# EasyEDA schematic RUN-Reset.json
TITLE: Sheet_1; REV: 1.0; Date: 2023-09-01; Sheet: 1/1; Drawn By: nicolasvig; Company: Your Company
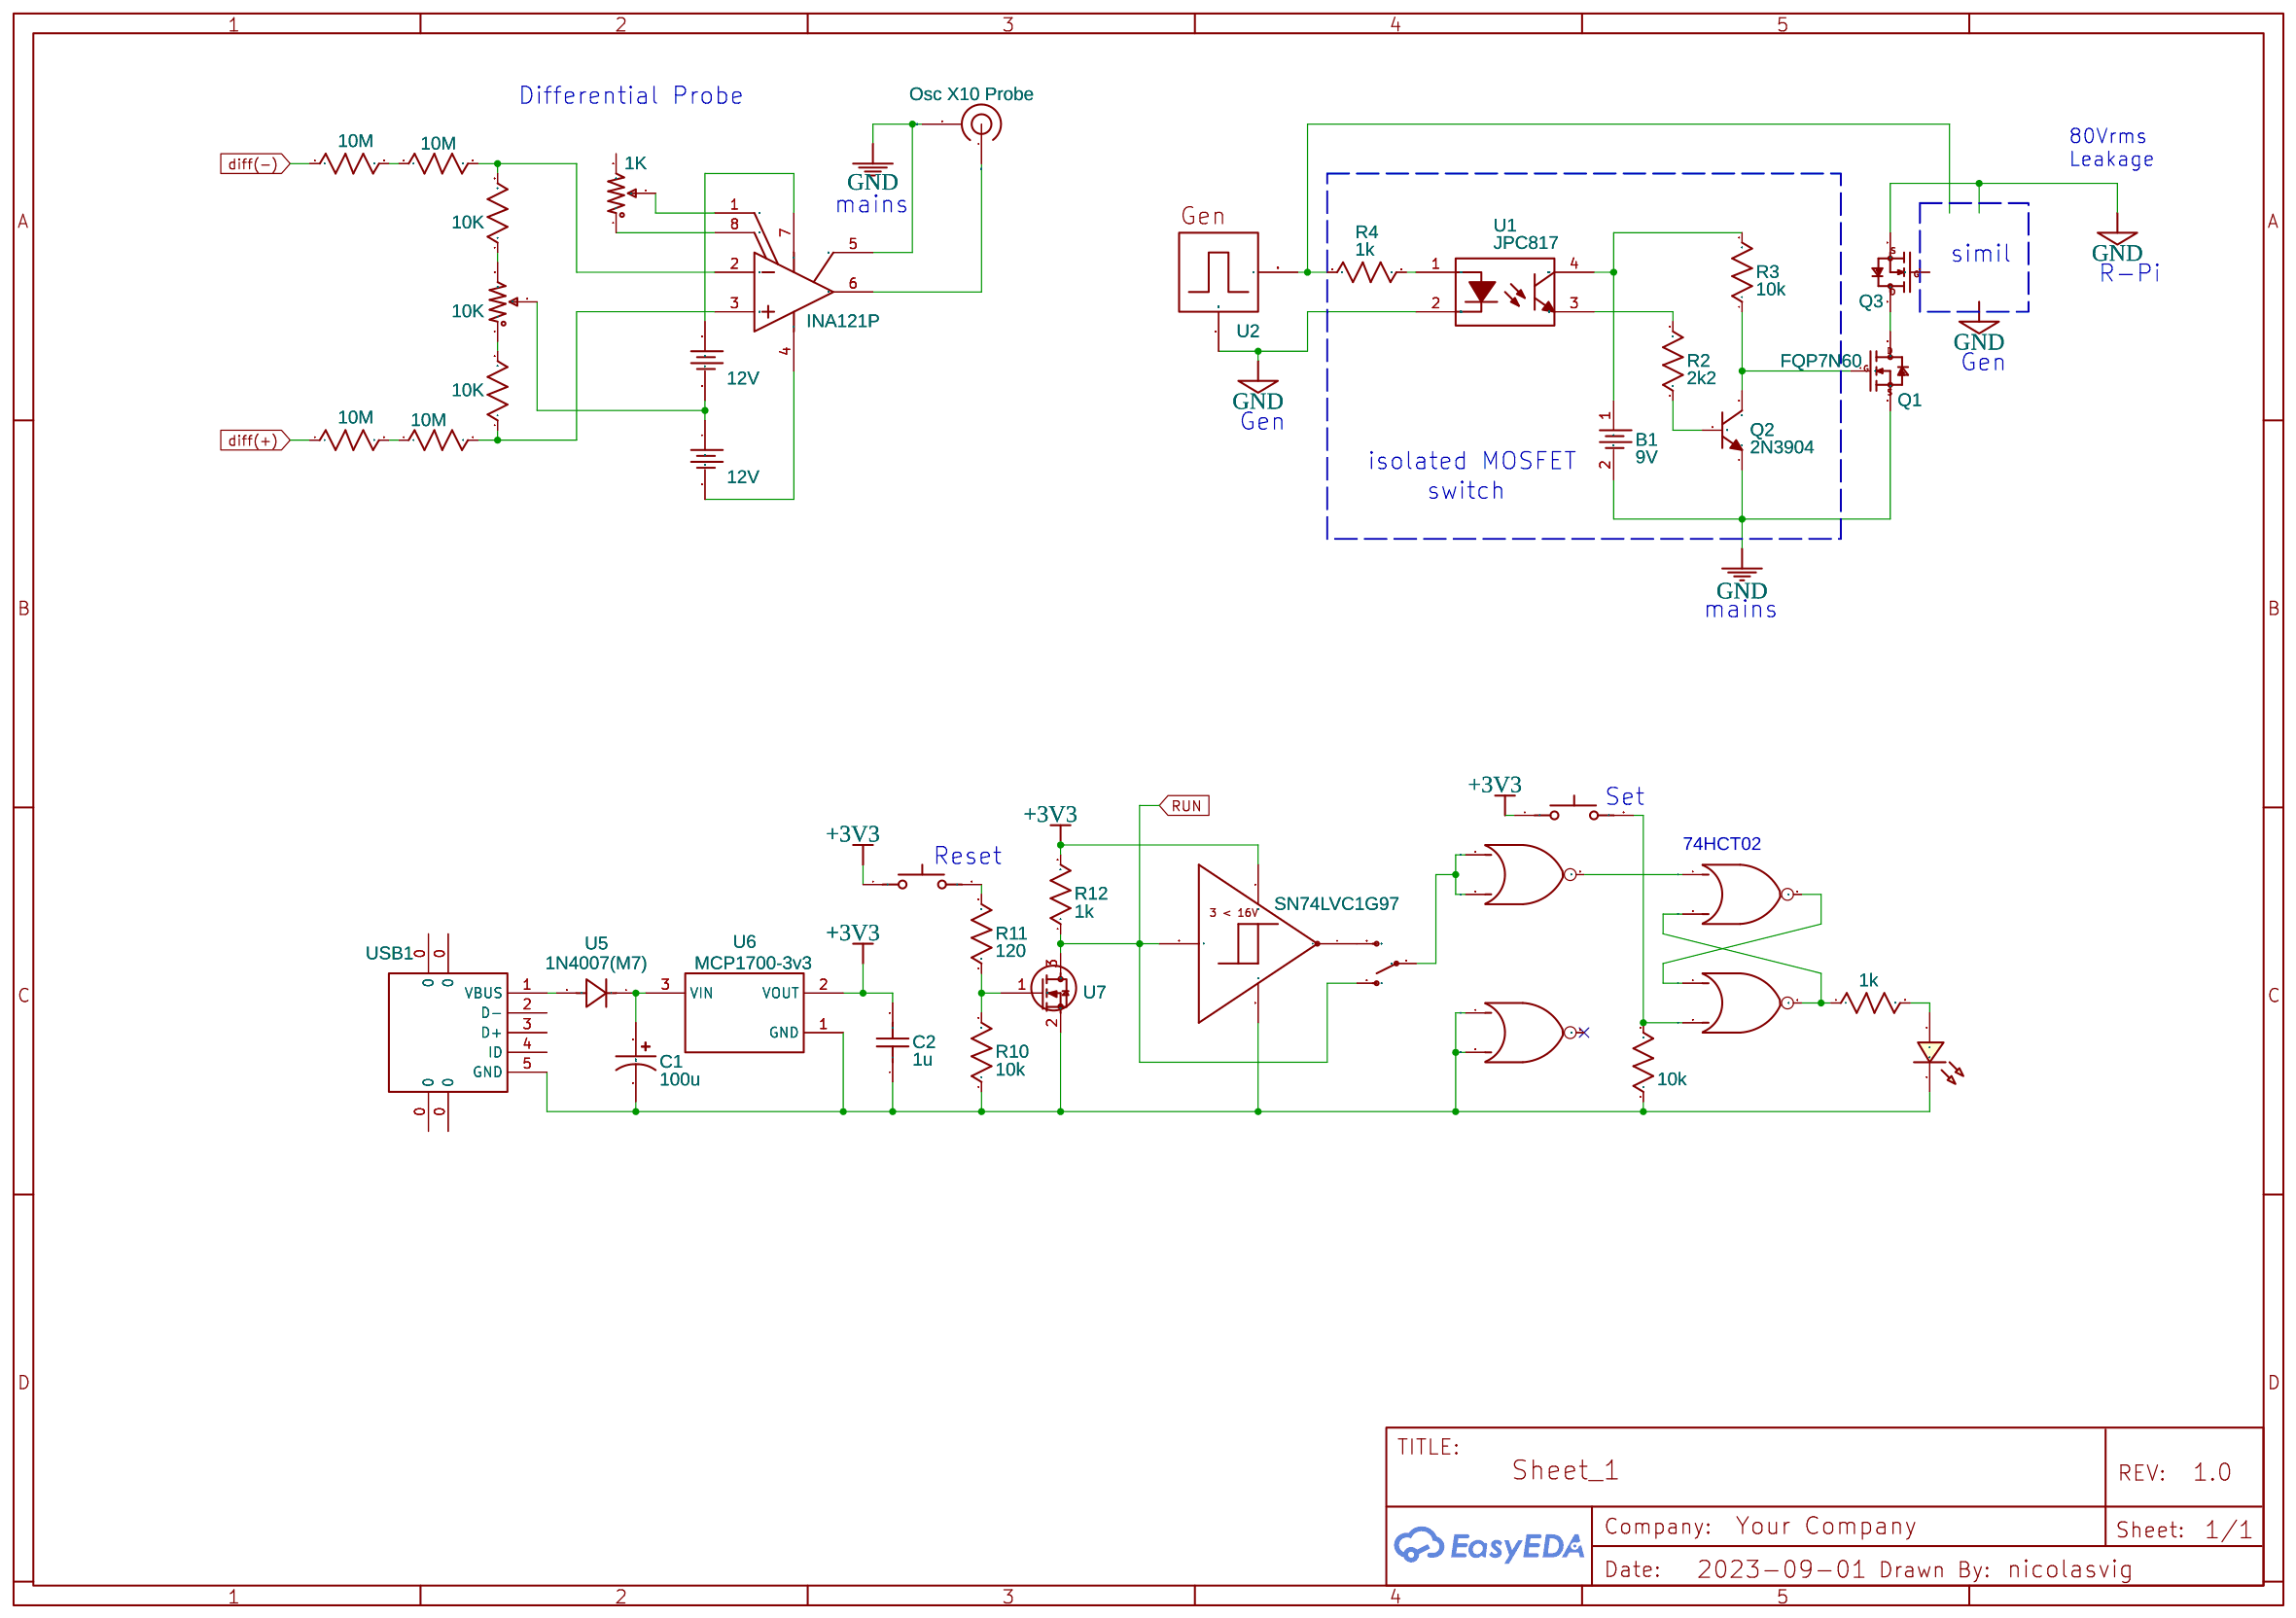
[diagram p0: schematic sheet]

## Parts
B1  9V  [BAT-SMD_CR1220-2]
B2  12V  [BAT-SMD_CR1220-2]
B3  12V  [BAT-SMD_CR1220-2]
C1  100u  [CASE-A_3216]
C2  1u  [C0603]
LED1  LED-0603_R  [LED0603_RED]
Q1  FQP7N60  [SEEED-SOT-23]
Q2  2N3904  [TO-92-3_L5.1-W4.1-P1.27-L]
Q3  NO  [SEEED-SOT-23]
R1  10M  [R0603]
R2  2k2  [R0603]
R3  10k  [R0603]
R4  1k  [R0603]
R5  10M  [R0603]
R6  10M  [R0603]
R7  10M  [R0603]
R8  10K  [R0603]
R9  10K  [R0603]
R10  10k  [R0603]
R11  120  [R0603]
R12  1k  [R0603]
R13  1k  [R0603]
R14  10k  [R0603]
RP1  1K  [RES-ADJ-TH_3386P]
RP2  10K  [RES-ADJ-TH_3386P]
S1  SWITCH-SPDT Panelmount  [STDP GABBAGABI]
SN74LVC1G97  -  [SCHMITT INVERTER]
U1  JPC817  [DIP-4_L6.5-W4.6-P2.54-LS7.6-BL]
U2  NO  [FUNCTION GENERATOR KK]
U3  Osc X10 Probe  [COAX PCB]
U4  INA121P  [PDIP-8_L9.5-W6.4-P2.54-LS7.6-BL]
U5  1N4007(M7)  [SMA_L4.3-W2.7-LS5.1-RD]
U6  MCP1700-3v3  [SOT-23-3_L2.9-W1.3-P1.90-LS2.4-BR]
U7  -  [2N7002]
U8  BUTTON2  [SW-SMD_L6.0-W3.5-LS8.0-1]
U9  -
U10  -
U11  -
U12  -
U13  BUTTON2  [SW-SMD_L6.0-W3.5-LS8.0-1]
USB1  micro 5P_C77238  [MICRO-USB_MICRO-USB-17]

## Library data of the parts
B1-B3 = CR1220-2: Supplier: LCSC; Manufacturer: Q&J; image: //image.lceda.cn/szlcsc/C70381.jpg; Supplier Part: C70381
C1 = C_Tan_SMD_A_US: Contributor: LCEDA_Lib
C2 = C_0603_US: Contributor: LCEDA_Lib
LED1 = LED-0603_R: Manufacturer: EVERLIGHT(台湾亿光); Manufacturer Part: 19-217/R6C-AL1M2VY/3T; Supplier Part: C72044; Supplier: LCSC; Contributor: LCEDA_01
Q1 Q3 = MOSFET-N: sourceId: lTtPN9uQc
Q2 = 2N3904: Supplier: LCSC; Manufacturer: ST(先科); Supplier Part: C118538; JLCPCB Part Class: Extended Part; link: https://lcsc.com/eda_search?q=C118538&%26type=1&ref=editor
R1-R14 = R_0603_US: Contributor: LCEDA_Lib
RP1 = R_3386P_US: Supplier: LCSC; Contributor: LCEDA_Lib; value(Ω): 10K
RP2 = R_3386P_US: Supplier: LCSC; Contributor: LCEDA_Lib
S1 = SWITCH-SPDT Panelmount: Contributor: gabbagabi
SN74LVC1G97 = Schmitt Inverter: Manufacturer: ROHM Semiconductor; Manufacturer Part: BU4S584G2-TR; Supplier: Mouser; link: https://www.mouser.tw/ProductDetail/ROHM-Semiconductor/BU4S584G2-TR?qs=%2Fha2pyFadujrli%252BPTslmoLvNkPYOHJBJfyhxRCxfzx0KWZPwSXGCuA%3D%3D; Contributor: hunglaa; Rated Power: 0.67; Rated Voltage: 16
U1 = JPC817: Contributor: lcsc; Supplier: LCSC; Supplier Part: C5365399; Manufacturer: JUXING(钜兴); link: https://lcsc.com/eda_search?q=C5365399&%26type=1&ref=editor
U2 = Function generator copy: Contributor: Schwamela
U3 = coax: Contributor: nomouelle
U4 = INA121P: Contributor: LCSC; Supplier: LCSC; Supplier Part: C1347772; Manufacturer: TI(德州仪器); JLCPCB Part Class: Extended Part; link: https://lcsc.com/eda_search?q=C1347772&%26type=1&ref=editor
U5 = 1N4007(M7): Contributor: lcsc; Supplier: LCSC; Supplier Part: C2988638; Manufacturer: UMW(广东友台半导体); JLCPCB Part Class: Extended Part; link: https://lcsc.com/eda_search?q=C2988638&%26type=1&ref=editor
U6 = MCP1700T-3002E/TT: Supplier: LCSC; Manufacturer: MICROCHIP(美国微芯); Supplier Part: C62244; JLCPCB Part Class: Extended Part; link: https://lcsc.com/eda_search?q=C62244&%26type=1&ref=editor
U7 = 2N7002-: Contributor: DrSavitaGaur; Supplier: SeeedStudio
U8 U13 = BUTTON2: Contributor: LCSC; Supplier: LCSC; Supplier Part: C9900005988; Manufacturer: null; JLCPCB Part Class: Extended Part; link: https://lcsc.com/eda_search?q=C9900005988&%26type=1&ref=editor
U9-U12 = NorGate
USB1 = micro 5P_C77238: Contributor: 立创EDA官方封装库; Supplier: LCSC; Supplier Part: C77238; Manufacturer: 精拓金; Manufacturer Part: 920-D62A2021S10107; JLCPCB Part Class: Extended Part; link: https://lcsc.com/eda_search?q=C77238&%26type=1&ref=editor

## Nets
+3V3: C2.2 R12.2 SN74LVC1G97.5 U6.2(VOUT) U8.1 U13.1
GND: B1.2 Q1.2(S) Q2.1(E) Q3.2(S) U1.2(Cathode) U2.1(Ground) U4.5(Ref)
diff(+): R7.1
diff(-): R6.1
RUN: R12.1 S1.2(O) SN74LVC1G97.2 U7.3(D)
Net-(B1-1): B1.1 R3.2 U1.4(Collector)
Net-(B2-1): B2.1 U4.7(V+)
Net-(B2-2): B2.2 B3.1 RP2.2
Net-(B3-2): B3.2 U4.4(V-)
Net-(C1-1): C1.1 U5.1(K) U6.3(VIN)
Net-(C1-2): C1.2 C2.1 LED1.2 R10.1 R14.1 SN74LVC1G97.3 U6.1(GND) U7.2(S) U10.1 U10.2 USB1.5(GND)
Net-(LED1-1): LED1.1 R13.2
Net-(Q1-1): Q1.1(G) Q2.3(C) R3.1
Net-(Q1-3): Q1.3(D) Q3.3(D)
Net-(Q2-2): Q2.2(B) R2.1
Net-(R1-1): R1.1 R6.2
Net-(R1-2): R1.2 R8.2 U4.2(V– IN)
Net-(R2-2): R2.2 U1.3(Emitter)
Net-(R4-1): R4.1 U2..(2)
Net-(R4-2): R4.2 U1.1(Anode)
Net-(R5-1): R5.1 R7.2
Net-(R5-2): R5.2 R9.1 U4.3(V+ IN)
Net-(R8-1): R8.1 RP2.3
Net-(R9-2): R9.2 RP2.1
Net-(R10-2): R10.2 R11.1 U7.1(G)
Net-(R11-2): R11.2 U8.2
Net-(R13-1): R13.1 U11.2 U12.3
Net-(R14-2): R14.2 U12.2 U13.2
Net-(RP1-1): RP1.1 U4.8(RG)
Net-(RP1-2): RP1.2 U4.1(RG)
Net-(S1-1): S1.1(P) U9.1 U9.2
Net-(S1-3): S1.3(S) SN74LVC1G97.4
Net-(U5-2): U5.2(A) USB1.1(VBUS)
Net-(U9-3): U9.3 U11.1
Net-(U11-3): U11.3 U12.1

Not connected (* = marked no-connect by the designer): Q3 1(G); RP1 3; U3 3(GND) 4(SIGNAL); U4 6(VO); U10 3*; USB1 0 2(D-) 3(D+) 4(ID)

## Notes on the sheet
- Differential Probe
- 80Vrms
  Leakage
- mains
- simil
- R-Pi
- Gen
- Gen
- isolated MOSFET
- switch
- mains
- Set
- 74HCT02
- Reset
